# EAGLE design sensor_eeprom_v2.0 (EAGLE 9.6.2)
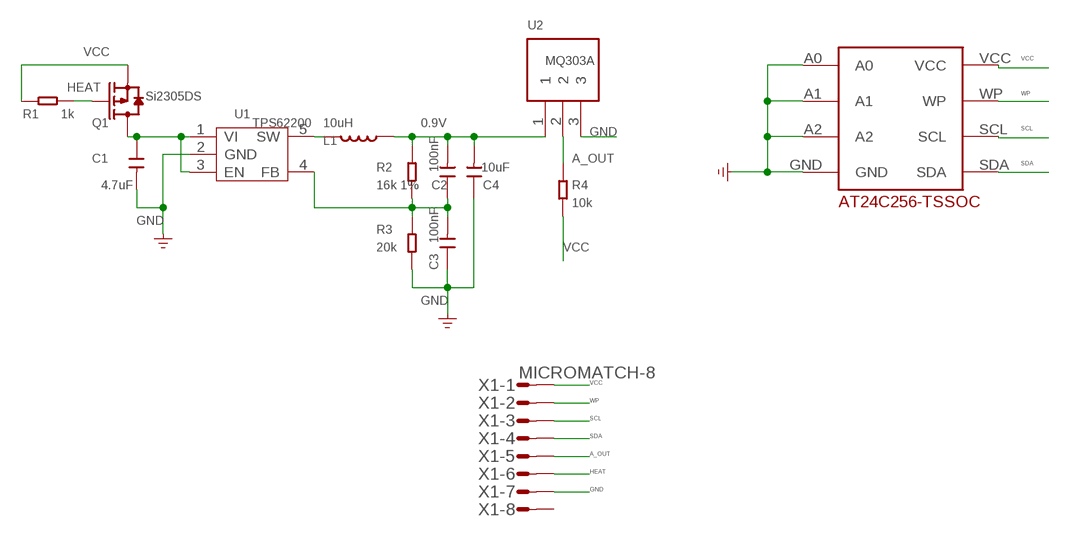
[diagram p0: schematic, sheet 1]

## Parts
C1  4.7uF  C-0805  [C0805]
C2  100nF  C-0603  [C0603]
C3  100nF  C-0603  [C0603]
C4  10uF  C-0805  [C0805]
L1  10uH  L'PIO73'  [PIO73]
Q1  Si2305DS  MOSFET-P'SI2323CDS/SI2305DS<BR>'  [SOT23]
R1  1k  R-0603  [R0603]
R2  16k 1%  R-0603  [R0603]
R3  20k  R-0603  [R0603]
R4  10k  R-0603  [R0603]
U1  TPS62200  TPS62200DBV  [SOT23-5]
U2  MQ303A  [MQ303A]
U$1  DECADE-AT24C256-10TI-2.7  [DECADE-AT24CXX]
X1  MICROMATCH-8  [MICROMATCH-8]

## Nets
0.9V: C2.2 C4.2 L1.2 R2.1 U2.1
A_OUT: R4.1 U2.2 X1.5
GND: C1.2 C3.1 C4.1 R3.2 U1.2(GND) U2.3 U$1.A0 U$1.A1 U$1.A2 U$1.GND X1.7
HEAT: Q1.1(G) R1.1 X1.6
N$1: C1.1 Q1.3(D) U1.1(VI) U1.3(EN)
N$2: L1.1 U1.5(SW)
N$3: C2.1 C3.2 R2.2 R3.1 U1.4(FB)
SCL: U$1.SCL X1.3
SDA: U$1.SDA X1.4
VCC: Q1.2(S) R1.2 R4.2 U$1.VCC X1.1
WP: U$1.WP X1.2
Unconnected: X1.8

## Library data of the parts
C1-C4 = Discrete:C*: Ceramic Capacitors
L1 = Discrete:L*
Q1 = Discrete:MOSFET-P
R1-R4 = Discrete:R*
U1 = IC:TPS62200: High-Efficiency,SOT23 STEP-DOWN,DC-DC Converter
U2 = MQ303A:MQ303A
U$1 = DECADE-libraries20151104:DECADE-AT24C256-10TI-2.7
X1 = con-amp-micromatch:MICROMATCH-8: MicroMaTch 8 7-215464-8 / 0-215464-8 Drawing Number C-215464 DDEController.pdf; MF: FARNELL; MPN: 7-215464-8; OC_FARNELL: 3784642; OC_NEWARK: 26H0301

## Board
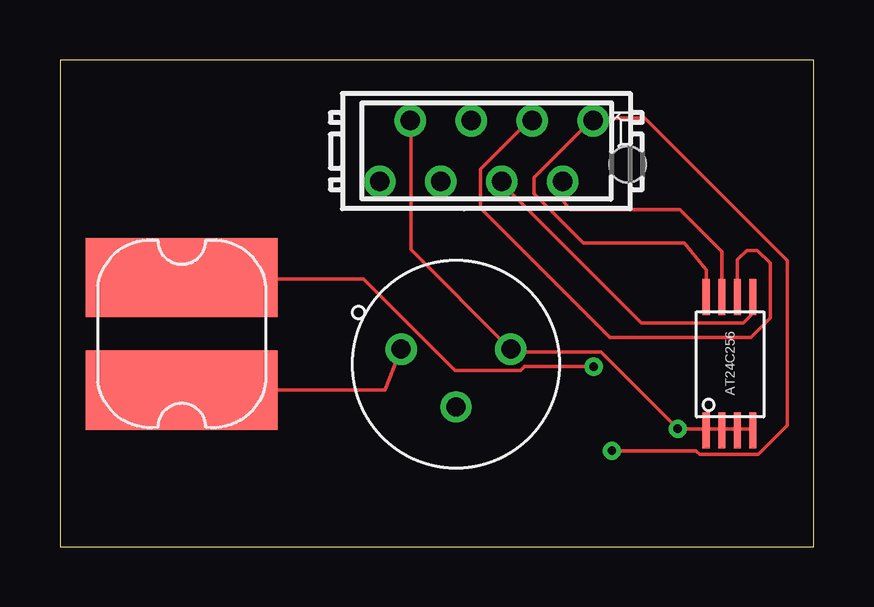
[diagram p1: board, top side]
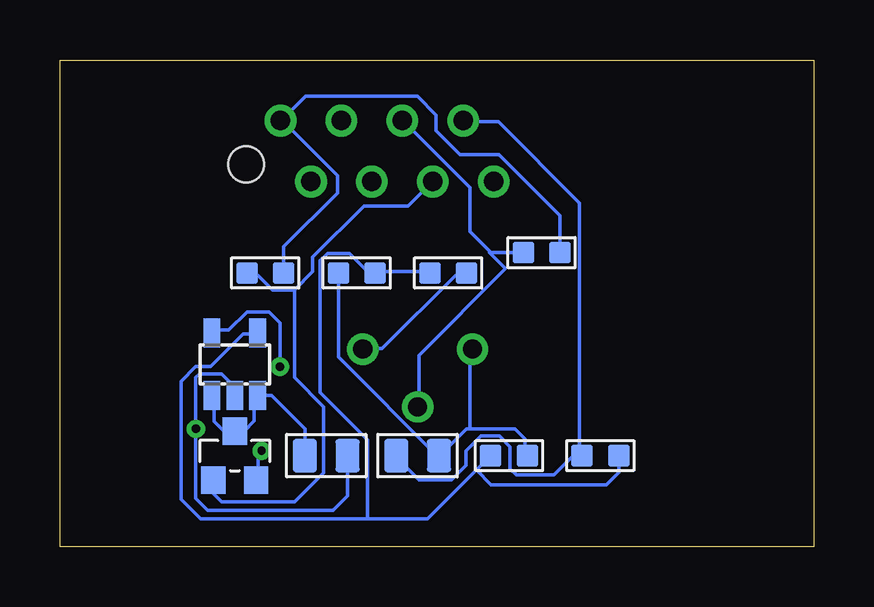
[diagram p2: board, bottom side, seen from below]

Size 31.42 x 20.31 mm. Coordinates in mm from the lower left corner, seen from the top.
Outline: 0,0 31.42,0 31.42,20.31 0,20.31 0,0
Copper layers (1*16): Top 0.035mm / dielectric 1.5mm / Bottom 0.035mm
Design rules "default": minimum track width 6mil, minimum drill 0.35mm, track to track 6mil, track to pad 6mil, pad to pad 6mil, via to via 6mil, smd to smd 6mil, copper to edge 40mil, drill to drill 6mil, minimum pad ring 10mil, minimum via ring 8mil, stop-mask expansion 4mil, vias tented up to drill 0mil, thermal gap 10mil

### Footprints (pad centres in the part's own frame; a part is rotated, then mirrored left to right if it is on the bottom)
C0805 = smd 1.016 x 1.397: 1 -0.889,0; 2 0.889,0
C0603 = smd 0.889 x 0.889: 1 -0.762,0; 2 0.762,0
PIO73 = smd 8 x 3.3: 1 0,2.35; 2 0,-2.35
SOT23 = smd 1.016 x 1.143: 1 -0.889,-1.016; 2 0.889,-1.016; 3 0,1.016
R0603 = smd 0.889 x 0.889: 1 -0.762,0; 2 0.762,0
SOT23-5 = smd 0.69 x 1.2: 1 -0.95,-1.3; 2 0,-1.3; 3 0.95,-1.3; 4 0.95,1.3; 5 -0.95,1.3
MQ303A = drill 0.8: 1 -2.286,0.635; 2 0,-1.778; 3 2.286,0.635
DECADE-AT24CXX = smd 1.5 x 0.3: A0 -2.75,1; A1 -2.75,0.35; A2 -2.75,-0.3; GND -2.75,-0.95; SCL 2.8,-0.3; SDA 2.8,-0.95; VCC 2.8,1; WP 2.8,0.35
MICROMATCH-8 = drill 0.813: 1 4.445,1.27; 2 3.175,-1.27; 3 1.905,1.27; 4 0.635,-1.27; 5 -0.635,1.27; 6 -1.905,-1.27; 7 -3.175,1.27; 8 -4.445,-1.27 | hole 1.5: 5.88,-0.55

### Placement (x,y rotation side)
C1  20.32,3.81 0 bottom
C2  12.7,3.81 0 bottom
C3  8.89,3.81 0 bottom
C4  16.51,3.81 0 bottom
L1  5.08,8.89 0 top
Q1  24.13,3.81 0 bottom
R1  22.86,11.43 0 bottom
R2  19.05,11.43 0 bottom
R3  15.24,11.43 0 bottom
R4  11.34,12.27 0 bottom
U1  24.13,7.62 0 bottom
U2  16.51,7.62 0 top
U$1  27.94,7.62 90 top
X1  17.78,16.51 0 top

### Tracks (layer width: path | path; a pad name or v marks a point on that pad's centre or on a via)
0.9V
  Top 0.152: U2.1 13.55,6.56 5.11,6.56 L1.2
  Bottom 0.152: 14.33,4.93 14.48,4.93 15.55,3.86 C4.2 15.65,3.77 19.81,7.92 R2.1 | 14.33,4.93 12.45,4.93 12.04,4.52 12.04,3.87 12.04,3.86 C2.2 | 14.33,4.93 14.33,8.13 U2.1
A_OUT
  Bottom 0.152: 13.45,12.28 13.51,12.28 12.84,11.61 16.46,8 16.46,5.84 U2.2 | 13.45,12.28 R4.1 | 13.45,12.28 14.33,13.16 14.33,14.99 17.07,17.73 X1.5
GND  (via drill 0.35)
  Top 0.152: U$1.GND 28.8,4.93 28.35,4.93 U$1.A2 28.19,4.93 27.74,4.93 U$1.A1 27.58,4.93 26.97,4.93 U$1.A0 26.82,4.93 v25.76,4.93 22.56,8.13 18.9,8.13 U2.3 18.75,8.28 14.63,12.4 14.63,17.73 X1.7
  Bottom 0.152: C1.2 19.43,2.13 20.03,1.54 25.26,1.54 25.76,2.03 v25.76,4.93 25.76,7.06 25.6,7.21 24.69,7.21 24.23,6.76 24.23,6.45 U1.2 | C4.1 17.37,3.71 16.46,2.79 15.09,2.79 14.48,3.4 14.48,4.01 13.87,4.62 13.11,4.62 12.65,4.17 12.65,3.25 12.4,3 10.83,3 10.12,3.71 9.75,3.71 C3.1 9.75,3.86 9.75,14.34 13.14,17.73 14.48,17.73 X1.7 | R3.2 14.48,11.33 14.94,11.33 17.98,8.28 18.75,8.28 U2.3
HEAT
  Bottom 0.152: 21.64,10.72 22.56,10.72 23.17,11.33 23.62,11.33 R1.1 | 21.64,10.72 20.88,11.48 20.88,12.09 18.75,14.22 16.92,14.22 16,15.14 X1.6 | Q1.1 25.02,2.22 24.67,1.88 21.64,1.88 20.42,3.1 20.42,5.84 21.64,7.06 21.64,10.72
N$1
  Bottom 0.152: U1.1 24.99,6.3 24.99,5.24 24.58,4.83 Q1.3 23.75,4.83 23.32,5.26 23.32,5.84 | 23.32,5.84 23.32,6.3 U1.3 | C1.1 21.2,3.82 21.2,4.92 22.59,6.32 U1.3 | 23.32,5.84 U1.3
N$2  (via drill 0.35)
  Top 0.152: v22.25,7.52 19.36,7.52 19.2,7.37 16.46,7.37 12.65,11.18 5.18,11.18 L1.1
  Bottom 0.152: v22.25,7.52 22.25,9.35 22.71,9.8 23.62,9.8 24.38,9.04 24.99,9.04 U1.5
N$3
  Bottom 0.152: 18.29,11.48 16,11.48 R3.1 | C3.2 8.13,3.11 8.64,2.59 13.45,2.59 14.06,3.21 | 18.59,1.17 16.1,1.17 14.06,3.21 | 18.59,1.17 25.55,1.17 26.36,1.98 26.36,6.91 25.76,7.52 25.15,7.52 23.77,8.89 23.32,8.89 U1.4 | C2.1 14.06,3.21 | 18.29,11.48 18.59,11.48 19.36,12.24 20.27,12.24 20.57,11.94 20.57,6.45 18.59,4.47 18.59,1.17 | 18.29,11.48 R2.2
SCL
  Top 0.152: U$1.SCL 28.25,11.98 28.64,12.37 29.08,12.37 29.61,11.84 29.61,9.55 28.8,8.74 22.92,8.74 17.53,14.13 17.53,15.75 19.66,17.88 X1.3
SDA
  Top 0.152: U$1.SDA 28.8,10.41 28.8,9.65 28.5,9.35 24.23,9.35 18.44,15.14 X1.4
VCC  (via drill 0.35)
  Top 0.152: v23.01,4.01 26.52,4.01 26.67,3.86 29.11,3.86 30.32,5.07 30.32,11.95 24.38,17.88 22.25,17.88 X1.1 22.1,17.73 19.76,15.4 19.76,14.73 21.83,12.67 26.04,12.67 26.94,11.54 U$1.VCC
  Bottom 0.152: R4.2 10.58,13.83 13.11,16.37 14.73,16.37 15.73,17.36 15.73,18.02 16.51,18.8 21.18,18.8 22.1,17.88 X1.1 22.1,17.73 19.85,15.49 19.85,14.76 22.1,12.52 R1.2 | v23.01,4.01 23.17,3.86 23.17,2.79 Q1.2
WP
  Top 0.152: U$1.WP 27.58,10.57 27.58,12.32 25.84,14.07 21.26,14.07 20.95,14.47 X1.2